# Altium schematic sheet LCD Ohmmeter.SchDoc
size A
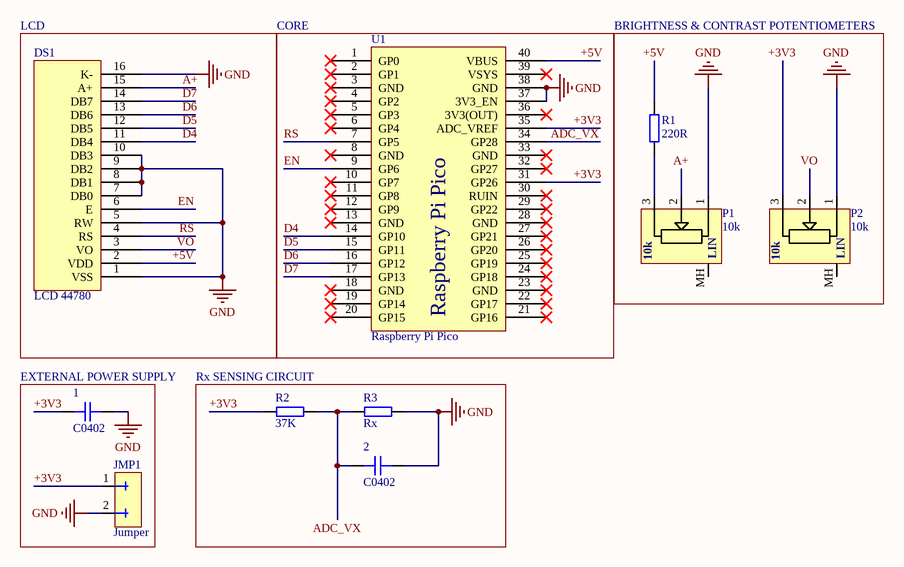
[diagram p0: LCD Ohmmeter.SchDoc]

## Parts
1  C0402  [CAP_0402]
2  C0402  [CAP_0402]
DS1  LCD 44780  [OLED 16x2]
JMP1  Jumper  [JMP2_TH]
P1  10k  [RK09L1140A5L]
P2  10k  [RK09L1140A5L]
R1  220R  [RES_0402]
R2  37K  [RES_0402]
R3  Rx  [RES_0402]
U1  Raspberry Pi Pico  [Raspberry Pi Pico]

## Blocks framed on the sheet
CORE: U1
BRIGHTNESS & CONTRAST POTENTIOMETERS: P1 P2 R1
EXTERNAL POWER SUPPLY: 1 JMP1
Rx SENSING CIRCUIT: 2 R2 R3

## Nets
GND: 1.2 2.2 DS1.1(VSS) DS1.5(RW) DS1.7(DB0) DS1.8(DB1) DS1.9(DB2) DS1.10(DB3) DS1.16(K-) JMP1.2 P1.1 P2.1 R3.1 U1.37(3V3_EN) U1.38(GND)
+3V3: 1.1 JMP1.1 P2.3 R2.2 U1.31(GP26) U1.35(ADC_VREF)
+5V: DS1.2(VDD) R1.2 U1.40(VBUS)
A+: DS1.15(A+) P1.2
ADC_VX: 2.1 R2.1 R3.2 U1.34(GP28)
D4: DS1.11(DB4) U1.14(GP10)
D5: DS1.12(DB5) U1.15(GP11)
D6: DS1.13(DB6) U1.16(GP12)
D7: DS1.14(DB7) U1.17(GP13)
EN: DS1.6(E) U1.9(GP6)
RS: DS1.4(RS) U1.7(GP5)
VO: DS1.3(VO) P2.2
NetP1_3: P1.3 R1.1

Not connected (* = marked no-connect by the designer): P1 MH; P2 MH; U1 1(GP0)* 2(GP1)* 3(GND)* 4(GP2)* 5(GP3)* 6(GP4)* 8(GND)* 10(GP7)* 11(GP8)* 12(GP9)* 13(GND)* 18(GND)* 19(GP14)* 20(GP15)* 21(GP16)* 22(GP17)* 23(GND)* 24(GP18)* 25(GP19)* 26(GP20)* 27(GP21)* 28(GND)* 29(GP22)* 30(RUIN)* 32(GP27)* 33(GND)* 36(3V3(OUT))* 39(VSYS)*

## Notes on the sheet
- LCD
- (in symbol RK09L1140A5L) LIN

## Library data of the parts
1 2 = CAP_0402: Capacitor SMD 0402; Manufacturer: *; Manufacturer Part Number: *; Distributor Link: *; LCSC: *; Rating: *; Dielectric: *
JMP1 = JMP2_TH: Jumper 2 Pins Through-Hole DO NOT PLACE
P1 P2 = RK09L1140A5L: Potentiometer Vertical 10k Linear Taper (1B) THT PCB-Mount D-Type 6mm Shaft; Manufacturer: Alps Alpine; Manufacturer Part Number: RK09L1140A5L
R1-R3 = RES_0402: Resistor SMD 0402; Manufacturer: *; Manufacturer Part Number: *; Distributor Link: *; LCSC: *